# Altium schematic sheet karmanDB_sensors2.SchDoc
size A
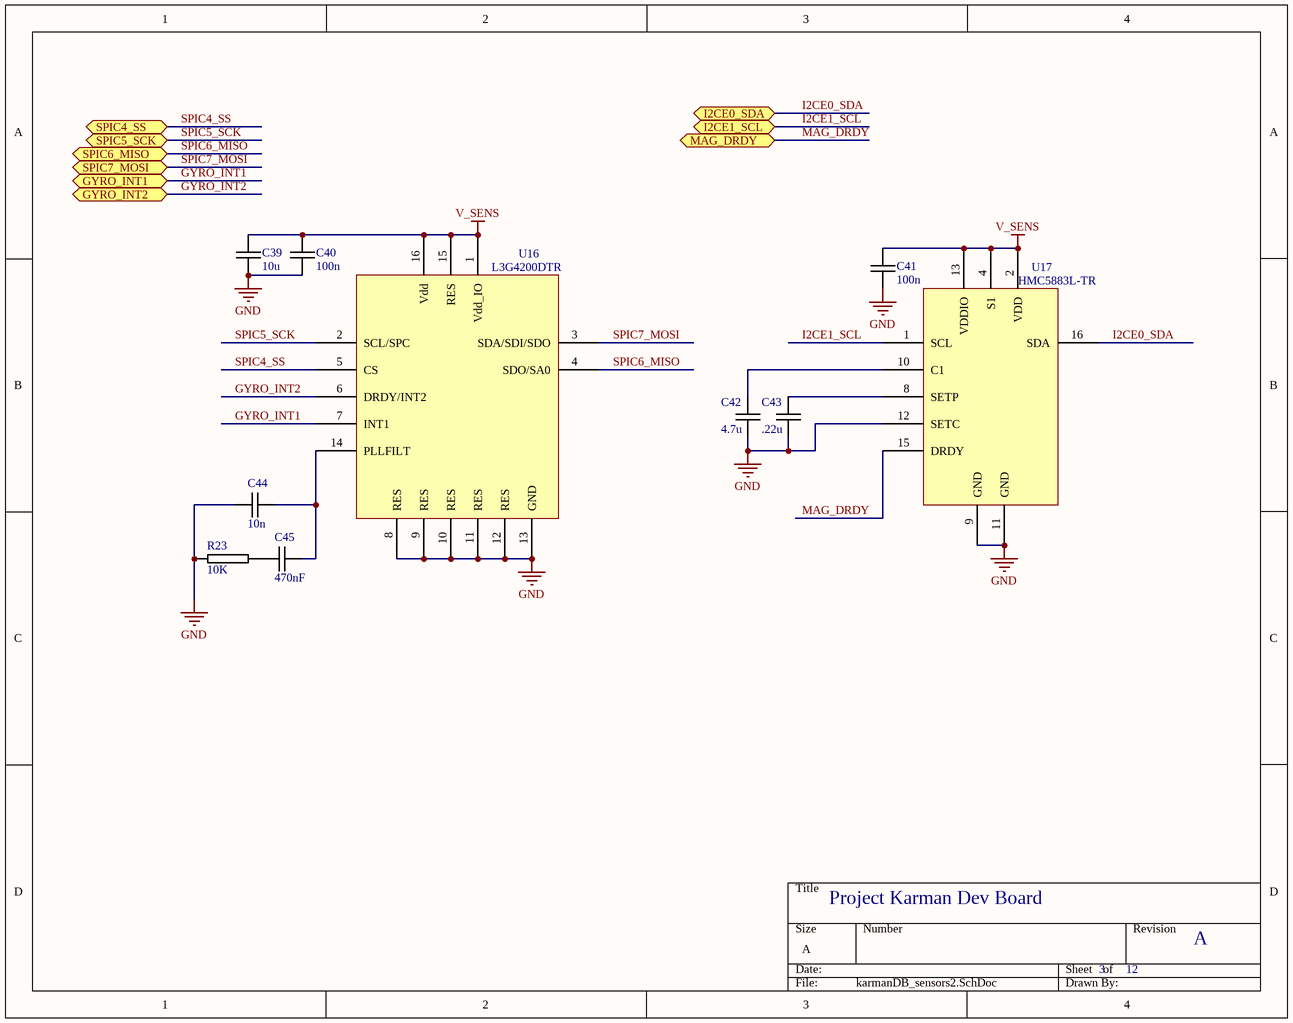
[diagram p0: karmanDB_sensors2.SchDoc]

## Parts
C39  10u  [MURATA_GRM_0603]
C40  100n  [MURATA_GRM_0603]
C41  100n  [MURATA_GRM_0603]
C42  4.7u  [MURATA_GRM_0603]
C43  .22u  [MURATA_GRM_0603]
C44  10n  [MURATA_GRM_0402]
C45  470nF  [MURATA_GRM_0402]
R23  10K  [PANASONIC_ERJ3R]
U16  L3G4200DTR  [4 L3G4200D]
U17  HMC5883L-TR  [5 HMC5883L-TR]

## Ports
GYRO_INT1 (bidir), GYRO_INT2 (bidir), I2CE0_SDA (bidir), I2CE1_SCL (bidir), MAG_DRDY (bidir), SPIC4_SS (bidir), SPIC5_SCK (bidir), SPIC6_MISO (bidir), SPIC7_MOSI (bidir)

## Nets
GND: C39.2 C40.2 C41.2 C42.2 C43.2 C44.1 R23.1 U16.8(RES) U16.9(RES) U16.10(RES) U16.11(RES) U16.12(RES) U16.13(GND) U17.9(GND) U17.11(GND) U17.12(SETC)
V_SENS: C39.1 C40.1 C41.1 U16.1(Vdd_IO) U16.15(RES) U16.16(Vdd) U17.2(VDD) U17.4(S1) U17.13(VDDIO)
GYRO_INT1: U16.7(INT1) ; port GYRO_INT1
GYRO_INT2: U16.6(DRDY/INT2) ; port GYRO_INT2
I2CE0_SDA: U17.16(SDA) ; port I2CE0_SDA
I2CE1_SCL: U17.1(SCL) ; port I2CE1_SCL
MAG_DRDY: U17.15(DRDY) ; port MAG_DRDY
SPIC4_SS: U16.5(CS) ; port SPIC4_SS
SPIC5_SCK: U16.2(SCL/SPC) ; port SPIC5_SCK
SPIC6_MISO: U16.4(SDO/SA0) ; port SPIC6_MISO
SPIC7_MOSI: U16.3(SDA/SDI/SDO) ; port SPIC7_MOSI
NetC42_1: C42.1 U17.10(C1)
NetC43_1: C43.1 U17.8(SETP)
NetC44_2: C44.2 C45.2 U16.14(PLLFILT)
NetC45_1: C45.1 R23.2

## Notes on the sheet
- Project Karman Dev Board
- 3
- 12
- A

## Library data of the parts
C39 = CAP_MURATA_GRM188R60J106: CAP CER 10UF 6.3V 20% X5R 0603; Manufacturer: Murata Electronics North America; Manufacturer Part Number: GRM188R60J106ME47J; Capacitance: 10µF; Supplier 1: Digi-Key; Supplier Part Number 1: 490-6405-1-ND; RoHS: RoHS Compliant; Category: Capacitors; Stock 1: 159118; Pricing: 1=0.19, 10=0.128, 50=0.0776, 100=0.0651, 250=0.05272, 500=0.0465, 1000=0.03953, 5000=0.03333 (USD); Packaging: Cut Tape (CT); Tolerance: ±20%; Voltage - Rated: 6.3V; Temperature Coefficient: X5R; Mounting Type: Surface Mount, MLCC; Operating Temperature: -55°C ~ 85°C; Applications: General Purpose; Ratings: -; Package / Case: 0603 (1608 Metric); Size / Dimension: 0.063" L x 0.031" W (1.60mm x 0.80mm); Height - Seated (Max): -; Thickness (Max): 0.035" (0.90mm); Lead Spacing: -; Features: -; Lead Style: -; ComponentLink1URL: http://www.murata.com/~/media/webrenewal/support/library/catalog/products/capacitor/mlcc/c02e.ashx; ComponentLink1Description: http://www.murata.com/~/media/webrenewal/support/library/catalog/products/capacitor/mlcc/c02e.ashx
C40 = CAP_MURATA_GRM188R70J104KA01D: CAP CER 0.1UF 6.3V 10% X7R 0603; Manufacturer: Murata Electronics North America; Capacitance: 0.1µF; Supplier 1: Digi-Key; Supplier Part Number 1: 490-9730-1-ND; Manufacturer Part Number: GRM188R70J104KA01D; RoHS: RoHS Compliant; Category: Capacitors; Stock 1: 25826; Pricing: 1=0.1, 10=0.061, 50=0.0332, 100=0.0281, 250=0.02296, 500=0.01964, 1000=0.0153 (USD); Packaging: Cut Tape (CT); Tolerance: ±10%; Voltage - Rated: 6.3V; Temperature Coefficient: X7R; Mounting Type: Surface Mount, MLCC; Operating Temperature: -55°C ~ 125°C; Applications: General Purpose; Ratings: -; Package / Case: 0603 (1608 Metric); Size / Dimension: 0.063" L x 0.031" W (1.60mm x 0.80mm); Height - Seated (Max): -; Thickness (Max): 0.035" (0.90mm); Lead Spacing: -; Features: -; Lead Style: -; ComponentLink1URL: http://www.murata.com/~/media/webrenewal/support/library/catalog/products/capacitor/mlcc/c02e.ashx; ComponentLink1Description: http://www.murata.com/~/media/webrenewal/support/library/catalog/products/capacitor/mlcc/c02e.ashx
C41 = CAP_MURATA_GRM188R71C104KA01D: CAP CER 0.1UF 16V 10% X7R 0603; Manufacturer: Murata Electronics North America; Capacitance: 0.1µF; Supplier 1: Digi-Key; Supplier Part Number 1: 490-1532-1-ND; Manufacturer Part Number: GRM188R71C104KA01D; RoHS: RoHS Compliant; Category: Capacitors; Stock 1: 2486193; Pricing: 1=0.1, 10=0.019, 50=0.0102, 100=0.0086, 250=0.00704, 500=0.006, 1000=0.00468 (USD); Packaging: Cut Tape (CT); Tolerance: ±10%; Voltage - Rated: 16V; Temperature Coefficient: X7R; Mounting Type: Surface Mount, MLCC; Operating Temperature: -55°C ~ 125°C; Applications: General Purpose; Ratings: -; Package / Case: 0603 (1608 Metric); Size / Dimension: 0.063" L x 0.031" W (1.60mm x 0.80mm); Height - Seated (Max): -; Thickness (Max): 0.035" (0.90mm); Lead Spacing: -; Features: -; Lead Style: -; ComponentLink1URL: http://www.murata.com/~/media/webrenewal/support/library/catalog/products/capacitor/mlcc/c02e.ashx; ComponentLink1Description: http://www.murata.com/~/media/webrenewal/support/library/catalog/products/capacitor/mlcc/c02e.ashx
C42 = CAP_MURATA_GRM188R61C475MAAJD: CAP CER 4.7UF 16V 20% X5R 0603; Manufacturer: Murata Electronics North America; Capacitance: 4.7µF; Supplier 1: Digi-Key; Supplier Part Number 1: 490-10482-1-ND; Manufacturer Part Number: GRM188R61C475MAAJD; RoHS: RoHS Compliant; Category: Capacitors; Stock 1: 3465; Pricing: 1=0.3, 10=0.251, 25=0.1728, 50=0.1414, 100=0.1256, 250=0.0942, 500=0.08322, 1000=0.07379 (USD); Packaging: Cut Tape (CT); Tolerance: ±20%; Voltage - Rated: 16V; Temperature Coefficient: X5R; Mounting Type: Surface Mount, MLCC; Operating Temperature: -55°C ~ 85°C; Applications: General Purpose; Ratings: -; Package / Case: 0603 (1608 Metric); Size / Dimension: 0.063" L x 0.031" W (1.60mm x 0.80mm); Height - Seated (Max): -; Thickness (Max): 0.037" (0.95mm); Lead Spacing: -; Features: -; Lead Style: -; ComponentLink1URL: http://www.murata.com/~/media/webrenewal/support/library/catalog/products/capacitor/mlcc/c02e.ashx; ComponentLink1Description: http://www.murata.com/~/media/webrenewal/support/library/catalog/products/capacitor/mlcc/c02e.ashx
C43 = CAP_MURATA_GRM188R71E224KA88D: CAP CER 0.22UF 25V 10% X7R 0603; Manufacturer: Murata Electronics North America; Capacitance: 0.22µF; Supplier 1: Digi-Key; Manufacturer Part Number: GRM188R71E224KA88D; RoHS: RoHS Compliant; Category: Capacitors; Stock 1: 267892; Pricing 1: 1=0.14, 10=0.098, 50=0.0564, 100=0.0466, 250=0.0392, 500=0.03284, 1000=0.02695 (USD); Packaging: Cut Tape (CT); Tolerance: ±10%; Voltage - Rated: 25V; Temperature Coefficient: X7R; Mounting Type: Surface Mount, MLCC; Operating Temperature: -55°C ~ 125°C; Applications: General Purpose; Ratings: -; Package / Case: 0603 (1608 Metric); Size / Dimension: 0.063" L x 0.031" W (1.60mm x 0.80mm); Height - Seated (Max): -; Thickness (Max): 0.035" (0.90mm); Lead Spacing: -; Features: -; Lead Style: -; ComponentLink1URL: http://www.murata.com/~/media/webrenewal/support/library/catalog/products/capacitor/mlcc/c02e.ashx; ComponentLink1Description: http://www.murata.com/~/media/webrenewal/support/library/catalog/products/capacitor/mlcc/c02e.ashx; Supplier Part Number 1: 490-3290-1-ND
C44 = CAP_MURATA_GRM155R71C103KA01D: CAP CER 10000PF 16V 10% X7R 0402; Manufacturer: Murata Electronics North America; Supplier 1: Digi-Key; Supplier Part Number 1: 490-1313-1-ND; Manufacturer Part Number: GRM155R71C103KA01D; RoHS: RoHS Compliant; Category: Capacitors; Stock 1: 2877462; Pricing: 1=0.1, 10=0.012, 50=0.0066, 100=0.0057, 250=0.00464, 500=0.00396, 1000=0.00309, 5000=0.00258 (USD); Packaging: Cut Tape (CT); Capacitance: 10000pF; Tolerance: ±10%; Voltage - Rated: 16V; Temperature Coefficient: X7R; Mounting Type: Surface Mount, MLCC; Operating Temperature: -55°C ~ 125°C; Applications: General Purpose; Ratings: -; Package / Case: 0402 (1005 Metric); Size / Dimension: 0.039" L x 0.020" W (1.00mm x 0.50mm); Height - Seated (Max): -; Thickness (Max): 0.022" (0.55mm); Lead Spacing: -; Features: -; Lead Style: -; ComponentLink1URL: http://www.murata.com/~/media/webrenewal/support/library/catalog/products/capacitor/mlcc/c02e.ashx; ComponentLink1Description: http://www.murata.com/~/media/webrenewal/support/library/catalog/products/capacitor/mlcc/c02e.ashx
C45 = CAP_MURATA_GRT155R61C474KE01D: CAP CER 0.47UF 16V 10% X5R 0402; Manufacturer: Murata Electronics North America; Capacitance: 0.47µF; Supplier 1: Digi-Key; Manufacturer Part Number: GRT155R61C474KE01D; RoHS: RoHS Compliant; Category: Capacitors; Stock 1: 0; Pricing 1: 10000=0.01176, 20000=0.0112, 30000=0.01064, 50000=0.00952, 100000=0.0077 (USD); Packaging: Tape & Reel (TR); Tolerance: ±10%; Voltage - Rated: 16V; Temperature Coefficient: X5R; Mounting Type: Surface Mount, MLCC; Operating Temperature: -55°C ~ 85°C; Applications: Automotive; Ratings: AEC-Q200; Package / Case: 0402 (1005 Metric); Size / Dimension: 0.039" L x 0.020" W (1.00mm x 0.50mm); Height - Seated (Max): -; Thickness (Max): 0.022" (0.55mm); Lead Spacing: -; Features: -; Lead Style: -; ComponentLink1URL: http://search.murata.co.jp/Ceramy/image/img/A01X/G101/ENG/GRT155R61C474KE01-01.pdf; ComponentLink1Description: http://search.murata.co.jp/Ceramy/image/img/A01X/G101/ENG/GRT155R61C474KE01-01.pdf; Supplier Part Number 1: 490-12261-2-ND
R23 = RES_PANASONIC_ERJ-3GEYJ103V: RES SMD 10K OHM 5% 1/10W 0603; Manufacturer: Panasonic Electronic Components; Power (Watts): 0.1W, 1/10W; Temperature Coefficient: ±200ppm/°C; Supplier 1: Digi-Key; Supplier Part Number 1: P10KGCT-ND; Manufacturer Part Number: ERJ-3GEYJ103V; RoHS: RoHS Compliant; Category: Resistors; Stock 1: 4229597; Pricing: 1=0.1, 50=0.0096, 100=0.0071, 250=0.00544, 500=0.00436, 1000=0.00321 (USD); Packaging: Cut Tape (CT); Resistance (Ohms): 10k; Tolerance: ±5%; Composition: Thick Film; Features: Automotive AEC-Q200; Operating Temperature: -55°C ~ 155°C; Package / Case: 0603 (1608 Metric); Supplier Device Package: 0603; Size / Dimension: 0.063" L x 0.031" W (1.60mm x 0.80mm); Height: 0.022" (0.55mm); Number of Terminations: 2; ComponentLink1URL: http://industrial.panasonic.com/www-cgi/jvcr13pz.cgi?E+PZ+3+AOA0001+ERJ3GEYJ103V+7+WW; ComponentLink1Description: http://industrial.panasonic.com/www-cgi/jvcr13pz.cgi?E+PZ+3+AOA0001+ERJ3GEYJ103V+7+WW
U16 = L3G4200DTR: IC GYROSCOPE MEMS 3AXIS LP 16LGA; Manufacturer: STMicroelectronics; Range °/s: ±250°/s, ±500°/s, ±2000°/s; Sensitivity: 70m°/s, 17.5m°/s, 8.75m°/s; Typical Bandwidth: 800Hz, 400Hz, 200Hz, 100Hz; Voltage - Supply: 2.4 V ~ 3.6 V; Current - Supply: 6.1mA; Output Type: I²C, SPI; Supplier 1: Digi-Key; Manufacturer Part Number: L3G4200DTR; RoHS: RoHS Compliant; Category: Sensors, Transducers; Stock 1: 5355; Pricing 1: 1=5.28, 10=4.25, 100=3.77, 250=3.48, 500=3.13, 1000=2.64001 (USD); Operating Temperature: -40°C ~ 85°C; Package / Case: 16-TFLGA; Supplier Device Package: 16-LGA (4x4); ComponentLink1URL: http://www.st.com/web/en/resource/technical/document/datasheet/CD00265057.pdf; ComponentLink1Description: http://www.st.com/web/en/resource/technical/document/datasheet/CD00265057.pdf; Supplier Part Number 1: 497-11071-1-ND
U17 = HMC5883L-TR: IC COMPASS 3 AXIS I2C 16LCC SMD; Manufacturer: Honeywell Microelectronics & Precision Sensors; Sensing Range: ±8G; Voltage - Supply: 2.16 V ~ 3.6 V; Current - Supply: 100µA; Output Type: I²C; Supplier 1: Digi-Key; Manufacturer Part Number: HMC5883L-TR; RoHS: RoHS Compliant; Category: Sensors, Transducers; Stock 1: 15448; Pricing 1: 1=3.3, 10=2.258, 25=2.0316, 50=1.902, 100=1.7963, 250=1.683, 500=1.6104, 1000=1.5477 (USD); Packaging: Cut Tape (CT); Type: Compass - Three Axis; Current - Output (Max): -; Features: Compass - Three Axis; Operating Temperature: -30°C ~ 85°C; Package / Case: 16-LCC; Supplier Device Package: 16-LCC; ComponentLink1URL: http://www51.honeywell.com/aero/common/documents/myaerospacecatalog-documents/Defense_Brochures-documents/HMC5883L_3-Axis_Digital_Compass_IC.pdf; ComponentLink1Description: http://www51.honeywell.com/aero/common/documents/myaerospacecatalog-documents/Defense_Brochures-documents/HMC5883L_3-Axis_Digital_Compass_IC.pdf; Supplier Part Number 1: 342-1082-1-ND